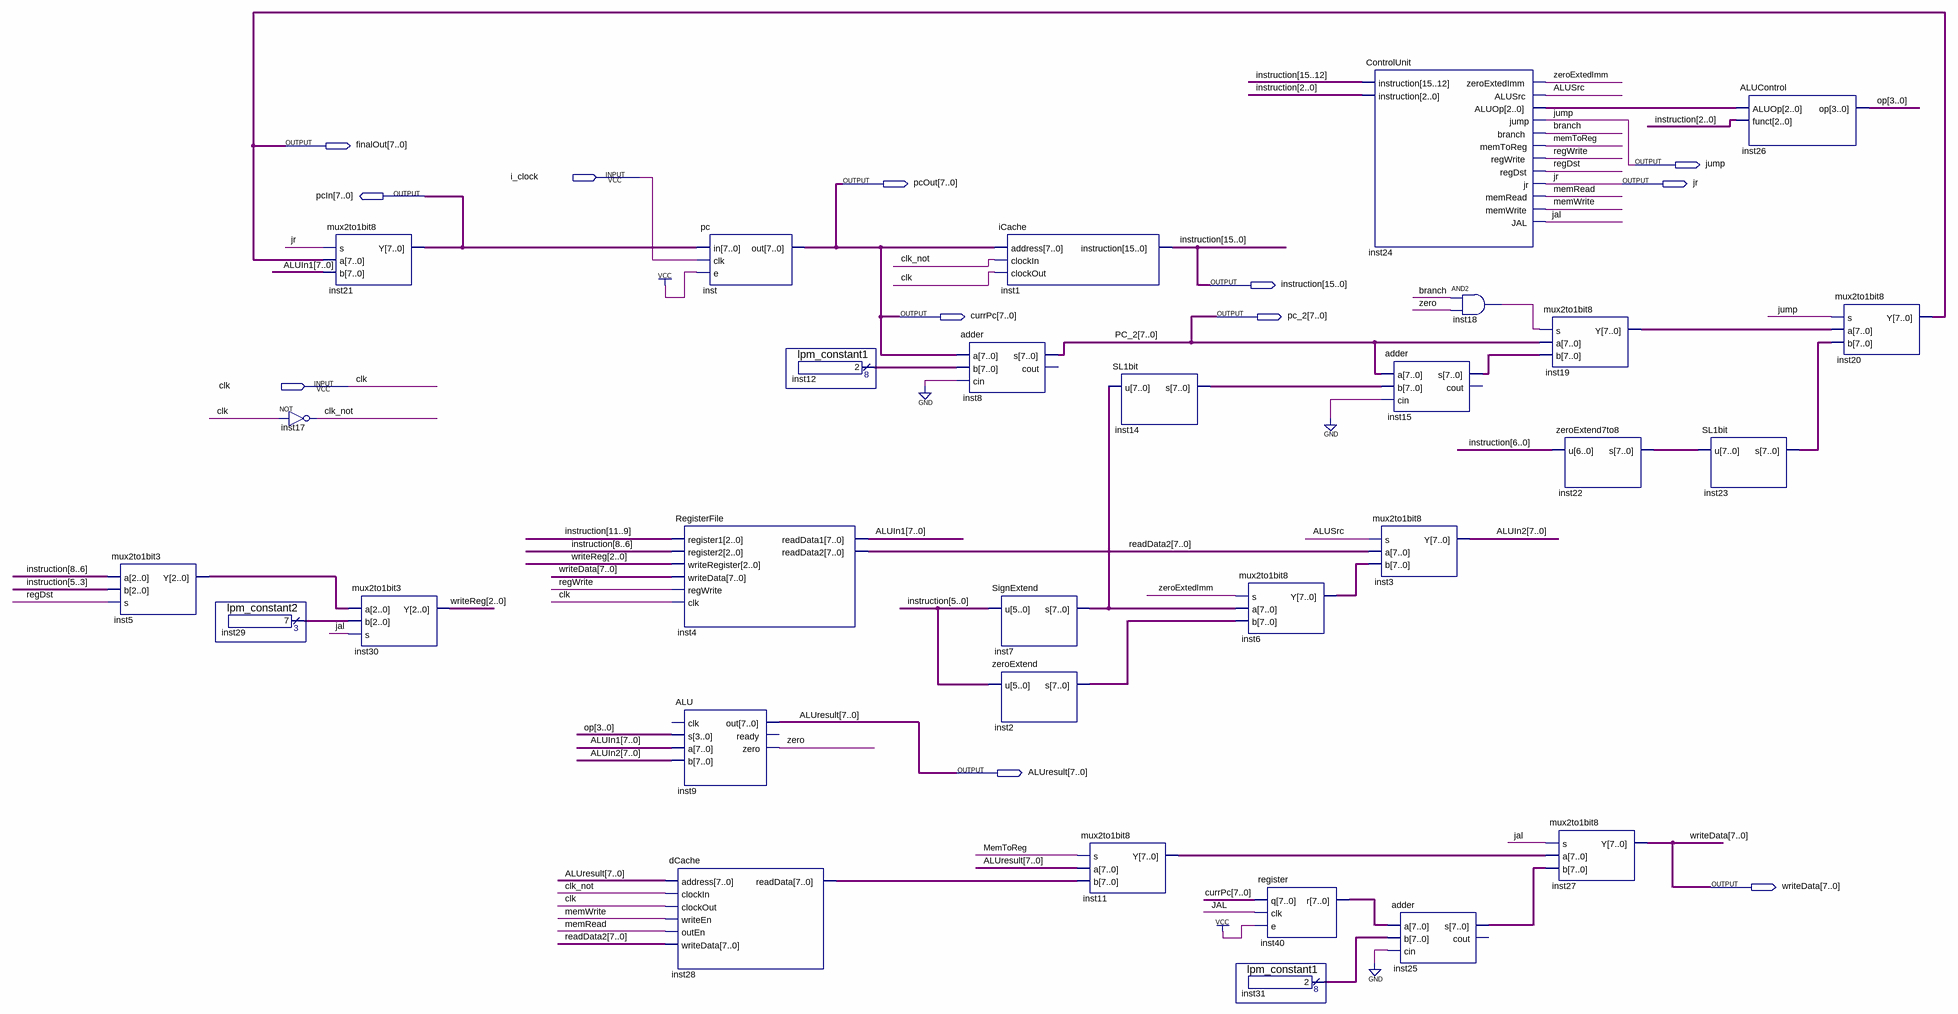
[diagram p0: schematic sheet]
// Quartus schematic datapath.bdf as structural Verilog: 30 symbols, 12 pins
module datapath (
  input  i_clock,
  input  clk,
  output [7:0] finalOut,
  output jump,
  output [7:0] pcOut,
  output jr,
  output [7:0] pcIn,
  output [15:0] instruction,
  output [7:0] currPc,
  output [7:0] pc_2,
  output [7:0] ALUresult,
  output [7:0] writeData
);

  wire ALUSrc, branch, clk_not, inst18_out, jal, memRead, MemToReg, memWrite, regDst, regWrite, zero,
       zeroExtedImm;
  wire [2:0] inst5_y, inst24_aluop, inst29_result, writeReg;
  wire [3:0] op;
  wire [7:0] ALUIn1, ALUIn2, inst2_s, inst6_y, inst7_s, inst11_y, inst12_result, inst14_s, inst15_s,
       inst19_y, inst22_s, inst23_s, inst25_s, inst28_readdata, inst31_result, inst40_r, readData2;

  mux2to1bit3 inst5 (.a(instruction[8:6]), .b(instruction[5:3]), .s(regDst), .Y(inst5_y));
  lpm_constant2 inst29 (.result(inst29_result));
  not inst17 (clk_not, clk);
  mux2to1bit8 inst21 (.s(jr), .a(finalOut), .b(ALUIn1), .Y(pcIn));
  mux2to1bit3 inst30 (.a(inst5_y), .b(inst29_result), .s(jal), .Y(writeReg));
  pc inst (.in(pcIn), .clk(i_clock), .e(1'b1), .out(currPc));
  RegisterFile inst4 (
    .register1(instruction[11:9]), .register2(instruction[8:6]), .writeRegister(writeReg),
    .writeData(writeData), .regWrite(regWrite), .clk(clk), .readData1(ALUIn1), .readData2(readData2));
  ALU inst9 (.s(op), .a(ALUIn1), .b(ALUIn2), .out(ALUresult), .zero(zero));  // open: clk, ready
  dCache inst28 (
    .address(ALUresult), .clockIn(clk_not), .clockOut(clk), .writeEn(memWrite), .outEn(memRead),
    .writeData(readData2), .readData(inst28_readdata));
  lpm_constant1 inst12 (.result(inst12_result));
  adder inst8 (.a(currPc), .b(inst12_result), .cin(1'b0), .s(pc_2));  // open: cout
  iCache inst1 (.address(currPc), .clockIn(clk_not), .clockOut(clk), .instruction(instruction));
  SignExtend inst7 (.u(instruction[5:0]), .s(inst7_s));
  zeroExtend inst2 (.u(instruction[5:0]), .s(inst2_s));
  SL1bit inst14 (.u(inst7_s), .s(inst14_s));
  mux2to1bit8 inst11 (.s(MemToReg), .a(ALUresult), .b(inst28_readdata), .Y(inst11_y));
  mux2to1bit8 inst6 (.s(zeroExtedImm), .a(inst7_s), .b(inst2_s), .Y(inst6_y));
  register inst40 (.q(currPc), .clk(jal), .e(1'b1), .r(inst40_r));
  lpm_constant1 inst31 (.result(inst31_result));
  ControlUnit inst24 (
    .instruction({instruction[15:12], instruction[2:0]}), .zeroExtedImm(zeroExtedImm), .ALUSrc(ALUSrc),
    .ALUOp(inst24_aluop), .jump(jump), .branch(branch), .memToReg(MemToReg), .regWrite(regWrite),
    .regDst(regDst), .jr(jr), .memRead(memRead), .memWrite(memWrite), .JAL(jal));
  adder inst15 (.a(pc_2), .b(inst14_s), .cin(1'b0), .s(inst15_s));  // open: cout
  mux2to1bit8 inst3 (.s(ALUSrc), .a(readData2), .b(inst6_y), .Y(ALUIn2));
  adder inst25 (.a(inst40_r), .b(inst31_result), .cin(1'b0), .s(inst25_s));  // open: cout
  and inst18 (inst18_out, branch, zero);
  mux2to1bit8 inst19 (.s(inst18_out), .a(pc_2), .b(inst15_s), .Y(inst19_y));
  zeroExtend7to8 inst22 (.u(instruction[6:0]), .s(inst22_s));
  mux2to1bit8 inst27 (.s(jal), .a(inst11_y), .b(inst25_s), .Y(writeData));
  SL1bit inst23 (.u(inst22_s), .s(inst23_s));
  ALUControl inst26 (.ALUOp(inst24_aluop), .funct(instruction[2:0]), .op(op));
  mux2to1bit8 inst20 (.s(jump), .a(inst19_y), .b(inst23_s), .Y(finalOut));

  assign pcOut = currPc;
endmodule
